# Altium project RGBColorSensor.PrjPcb
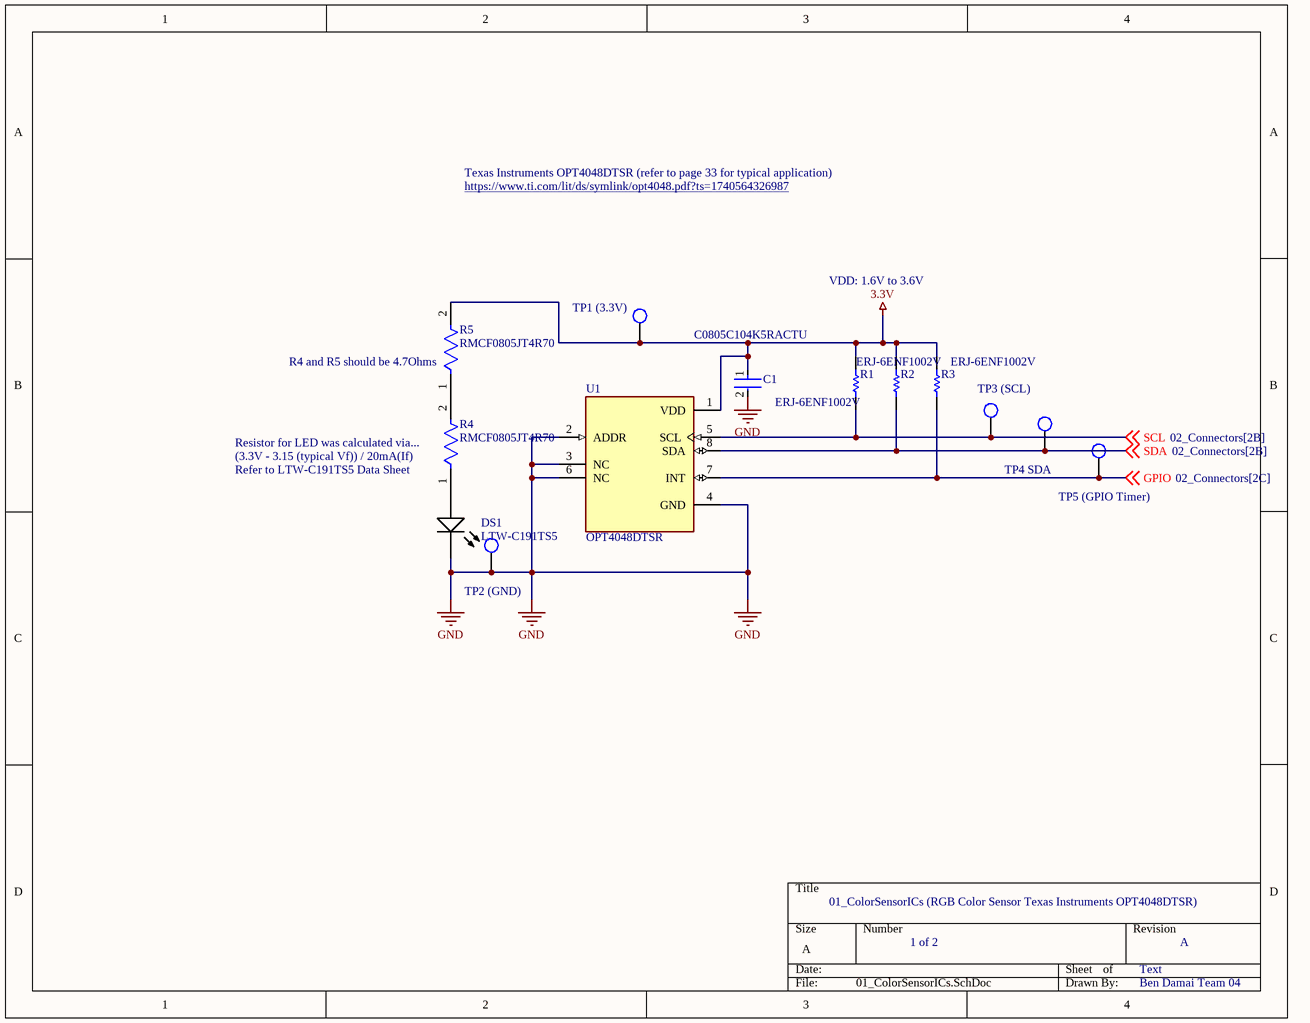
[diagram p0: 01_ColorSensorICs.SchDoc]
2 sheets, 14 parts. Net scope: global (net labels, ports and power ports of the same name join across sheets).
Board file: PCB1.PcbDoc
Sheets:
  01_ColorSensorICs.SchDoc
  02_Connectors.SchDoc

## Sheet 01_ColorSensorICs.SchDoc
size A; SheetNumber: 1; SheetTotal: 2

### Parts
C1  C0805C104K5RACTU  [FP-C0805C-DN-MFG]
DS1  LTW-C191TS5  [LTST-LTW-C191TS5_V]
R1  ERJ-6ENF1002V  [RESC2013X70X40ML20T20]
R2  ERJ-6ENF1002V  [RESC2013X70X40ML20T20]
R3  ERJ-6ENF1002V  [RESC2013X70X40ML20T20]
R4  RMCF0805JT4R70  [FP-RMCF0805-MFG]
R5  RMCF0805JT4R70  [FP-RMCF0805-MFG]
TP1_(3.3V)  TP_5019  [FP-5019-MFG]  (value not drawn)
TP2_(GND)  TP_5019  [FP-5019-MFG]  (value not drawn)
TP3_(SCL)  TP_5019  [FP-5019-MFG]  (value not drawn)
TP4_SDA  TP_5019  [FP-5019-MFG]  (value not drawn)
TP5_(GPIO_Timer)  TP_5019  [FP-5019-MFG]  (value not drawn)
U1  OPT4048DTSR  [SOTFL50P190X60-8N]

### Nets
3.3V: C1.1 R1.2 R2.2 R3.2 R5.2 TP1_(3.3V).1 U1.1(VDD)
GND: C1.2 DS1.2(K) TP2_(GND).1 U1.2(ADDR) U1.3(NC) U1.4(GND) U1.6(NC)
GPIO: R3.1 TP5_(GPIO_Timer).1 U1.7(INT) ; off-sheet GPIO
SCL: R1.1 TP3_(SCL).1 U1.5(SCL) ; off-sheet SCL
SDA: R2.1 TP4_SDA.1 U1.8(SDA) ; off-sheet SDA
NetDS1_1: DS1.1(A) R4.1
NetR4_2: R4.2 R5.1

### Notes on the sheet
- https://www.ti.com/lit/ds/symlink/opt4048.pdf?ts=1740564326987
- Texas Instruments OPT4048DTSR (refer to page 33 for typical application)
- VDD: 1.6V to 3.6V
- (near R5) R4 and R5 should be 4.7Ohms
- (near R4) Resistor for LED was calculated via...
- (near R4) (3.3V - 3.15 (typical Vf)) / 20mA(If)
- (near R4) Refer to LTW-C191TS5 Data Sheet
- 01_ColorSensorICs (RGB Color Sensor Texas Instruments OPT4048DTSR)
- 1 of 2
- Text
- A
- Ben Damai Team 04

### Library data of the parts
C1 = CMP-2007-00279-2: CAP CER 0.1UF 50V X7R 0805; Manufacturer: KEMET; Value: 0.10 μF; Tolerance: 0.1; Temperature Coefficient: 30ppm/°C; Material: Ceramic; Manufacturer Part Number: C0805C104K5RACTU; Device Class L2: Capacitors; Temperature Range Low: -55°C; Voltage Rating: 50 V; Digikey Description: CAP CER 0.1UF 50V X7R 0805; Category: Cap; ComponentLink2Description: Datasheet; Octopart: https://octopart.com/c0805c104k5ractu-kemet-143926; RoHS: TRUE; ComponentLink2URL: https://content.kemet.com/datasheets/KEM_C1003_C0G_SMD.pdf; Temperature Characteristic: X7R; Temperature: -55°C to +125°C; Height: 0.88mm; Temperature Range High: +125°C; Device Class L1: Passive Components; Automotive: No; Lead Free: Yes; Ipc Land Pattern Name: CAPC200125X78; Device Class L3: Ceramic Capacitors; Mouser Description: Cap Ceramic 0.1uF 50V X7R 10% SMD 2.0 x 1.2 mm 125 C Paper T/R; Capacitance: 0.10 μF; Package: C0805C-DN
DS1 = CMP-1674-00013-1: LED Uni-Color White, 70 mW, 20 mA, -20 to 80 degC, 2-Pin SMD, RoHS, Tape and Reel; Case\Package: 0603; Power Rating: 100 mW; Voltage Rating: 50 V; Tolerance: 1%; Resistance: 12 Ohm; Min Operating Temperature: -55 degC; Mount: Surface Mount; Pins: 2; Case Code (Imperial): 0603; PackageReference: LTW-C191TS5; ComponentLink2URL: http://optoelectronics.liteon.com/upload/download/DS22-2004-201/S_110_LTW-C191TS5.pdf; REACH SVHC: No SVHC; Max Operating Temperature: 155 degC; DatasheetVersion: Rev. B, 06/2010; Packaging: Tape and Reel; RoHSCompliant: true; Height: 0.45 mm; Length: 1.6 mm; Width: 0.8 mm; Voltage Rating (DC): 50 V; ComponentLink1URL: http://www.us.liteon.com/; PackageDescription: 2-Pin Surface Mount Device, Body 1.6 x 0.8 mm; ComponentLink1Description: Manufacturer URL; Case Code (Metric): 1608; Package Quantity: 5000; ComponentLink2Description: Datasheet
R1-R3 = CMP-2001-04376-1: Manufacturer: Panasonic; Part Number: ERJ-6ENF1002V
R4 R5 = CMP-26527-005191-1: 4.7Ω ±5% 0.125W 0805 Thick Film Chip Resistor AEC-Q200 compliant; Resistance: 4.7R; Temperature Coefficient: 200ppm/°C; Max Power Dissipation: 125mW; Height: 0.026inch; RoHS Compliant: Yes; Length: 0.079inch; Features: Automotive AEC-Q200; Case Code (Metric): 2012; Radiation Hardening: No; Case Code (Imperial): 0805; Resistor Type: Thick Film; Contact Plating: Tin; Tolerance: 5%; Packaging: Tape and Reel; Max Operating Temperature: 155°C; Number of Terminations: 2; Series: RMCF; Width: 0.049inch; Case/Package: 0805; Min Operating Temperature: -55°C; Mount: Surface Mount; Lead Free: Lead Free
TP1_(3.3V) TP2_(GND) TP3_(SCL) TP4_SDA TP5_(GPIO_Timer) = TP_5019: Test Point, Mini, SMT, Phos Bronze/Silver, 1000pc Tape & Reel | Keystone Electronics 5019; Manufacturer Part Number: 5019; Plating: Silver; Body Material: Bronze; Number of Contacts: 1NUMBER; Supplier 1: Digikey; Supplier Part Number 1: 36-5019CT-ND; Manufacturer: Keystone Electronics; RoHS: Yes; Category: Terminals; Stock: 282853; Pricing: 1=0.37, 25=0.2496, 100=0.2117, 250=0.1902, 500=0.1756, 1000=0.16229, 2000=0.15019, 3000=0.14362, 5000=0.13585, 7000=0.13102, 10000=0.12613, 25000=0.1211 (USD); Mounting Technology: Surface Mount,PCB; Pins: 1; Contact Plating: Silver; Contact Material: Bronze; Material: Bronze; Packaging: Tape and Reel; Package Quantity: 1; Termination: SMD/SMT; Series: 5019; Height: 0.09inch; Reach SVHC Compliant: No; RoHS Compliant: Yes; Lead Free: Lead Free; ComponentLink1URL: https://datasheet.ciiva.com/14848/m60-2p61-14848437.pdf?src-supplier=Digikey; ComponentLink1Description: https://datasheet.ciiva.com/14848/m60-2p61-14848437.pdf?src-supplier=Digikey; ComponentLink2URL: https://datasheet.ciiva.com/14848/m60-2p61-14848438.pdf?src-supplier=Digikey; ComponentLink2Description: https://datasheet.ciiva.com/14848/m60-2p61-14848438.pdf?src-supplier=Digikey; ComponentLink3URL: https://datasheet.ciiva.com/14848/m60-2p61-14848439.pdf?src-supplier=Digikey; ComponentLink3Description: https://datasheet.ciiva.com/14848/m60-2p61-14848439.pdf?src-supplier=Digikey; ComponentLink4URL: https://datasheet.ciiva.com/16885/70182998-16885945.pdf?src-supplier=Allied+Electronics; ComponentLink4Description: https://datasheet.ciiva.com/16885/70182998-16885945.pdf?src-supplier=Allied+Electronics; ComponentLink5URL: https://datasheet.ciiva.com/16318/m60-2p61-16318395.pdf?src-supplier=Future+Electronics; ComponentLink5Description: https://datasheet.ciiva.com/16318/m60-2p61-16318395.pdf?src-supplier=Future+Electronics
U1 = OPT4048DTSR: High-speed high-precision tristimulus XYZ color sensor; MF: Texas Instruments; SnapEDA_Link: https://www.snapeda.com/parts/OPT4048DTSR/Texas+Instruments/view-part/?ref=snap; Package: None; Value: *; MP: OPT4048DTSR; Check_prices: https://www.snapeda.com/parts/OPT4048DTSR/Texas+Instruments/view-part/?ref=eda

## Sheet 02_Connectors.SchDoc
size A; SheetNumber: 2; SheetTotal: 2
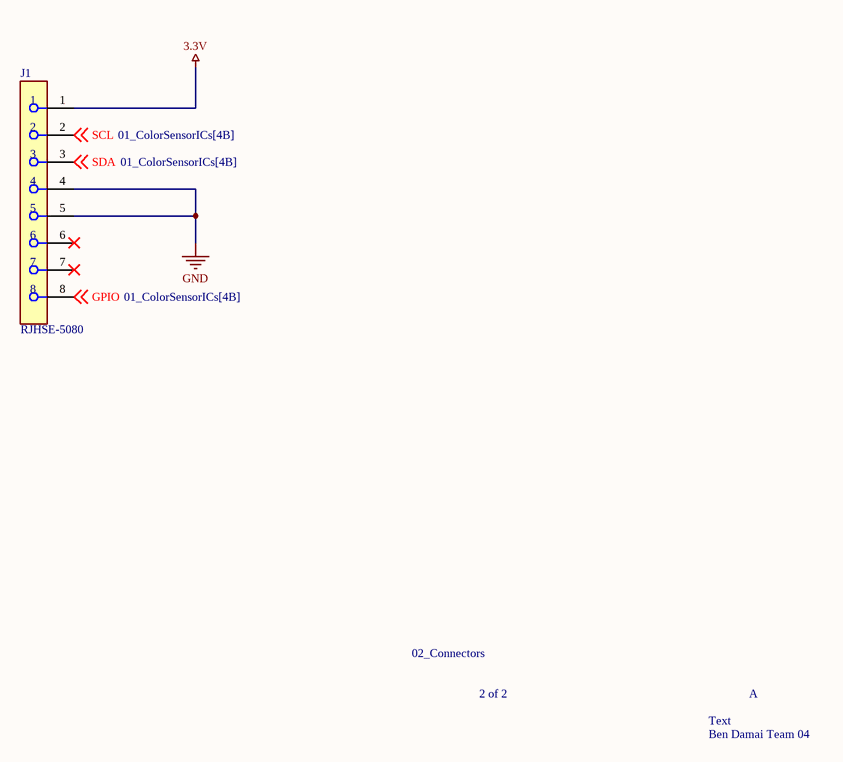
[diagram p1: 02_Connectors.SchDoc]

### Parts
J1  RJHSE-5080  [FP-RJHSE-5080-MFG]

### Nets
3.3V: J1.1
GND: J1.4 J1.5
GPIO: J1.8 ; off-sheet GPIO
SCL: J1.2 ; off-sheet SCL
SDA: J1.3 ; off-sheet SDA

Not connected (* = marked no-connect by the designer): J1 6* 7*

### Notes on the sheet
- 02_Connectors
- 2 of 2
- Text
- A
- Ben Damai Team 04

### Library data of the parts
J1 = CMP-02366-000003-1: CONN MOD JACK 8P8C R/A UNSHLD; Manufacturer: Amphenol; Current Rating: 1.5A; Voltage Rating: 125V; Pitch: 1.02mm; Conn Orientation: Right Angle; Number Of Contacts: 8; Is Female: yes; Conn Gender: Female; Contact Resistance: 20mR; Number of Ports: 1; Connector Type: RJ45; Lead Free: Yes; Device Class L3: unset; Footprint Url: https://cdn.amphenol-icc.com/media/wysiwyg/files/drawing/rjhse5080.pdf?__cf_chl_jschl_tk__=e349db0bbbb6188a39347cd5e541b92fa02c9719-1587748343-0-AW7tChdeHzRPLX9gSWj7WrKaXQoY9BsmT9Ek0h-T62M9y3Rs9iypFcOtkzb-6sGYQEjFE-jcoNciDETCOZrh1rYyOesac5SvYLoLwHIsHvF4AKBlx-MXmfZUVk9OTTJLqyQq2qMm0PFRLJpNcK0nrKResqOniRSYixG2sPTmOPraH-ULJFBDL602CHqcI9KKBgTq90Jh1OL2Td4moJ99rFsJRJ1Tk_uoxGe8ublcP_ARu-uLpWcQrBcwOcHDTAwL29DAwVaqcH7ta8Ks7WMlHmVl_pILeEDwT0bE9vu5Pa5S3PtNRF1leuFkgi_FMbUxTDulc5xzbXSfng8srUIV1lWXny5nx1fZJEUa_w97yKjffzBMxiWLWVN-V7-uqAaPbyv_m-wRyw5O25OZNyJOeGU; ComponentLink2URL: https://cdn.amphenol-icc.com/media/wysiwyg/files/documentation/datasheet/inputoutput/io-modjack-rjhse.pdf; Device Class L1: Connectors; Package: CONN_MOD_JACK; Mouser Description: Modular Connectors / Ethernet Connectors R/A RJ45 NONSHIELDED 8 CONT NO LEDS; Manufacturer Part Number: RJHSE-5080; Octopart: https://octopart.com/rjhse-5080-amphenol-45060; Category: Conn; Height: 0.535inch; Temperature: -55°C to +85°C; Digikey Description: CONN MOD JACK 8P8C R/A UNSHLD; Device Class L2: Modular / Ethernet Connectors; Contact Material: Gold,Nickel; ComponentLink2Description: Datasheet; Temperature Range Low: -55°C; RoHS: TRUE; Automotive: No; Temperature Range High: +85°C; Supplier: Digikey; Supplier Part Number: RJHSE-5080-ND; Stock: 72112; Pricing: 1=1.03, 10=0.867, 25=0.832, 50=0.8142, 100=0.7788, 250=0.708, 500=0.6372, 1000=0.56641, 2500=0.51331 (USD); Mounting Technology: Through Hole,Panel; Contact Plating: Gold; Max Current Rating: 1.5A; Number of Positions Loaded: 8; Max Voltage Rating (AC): 125V; Orientation: Right Angle; Packaging: Rail/Tube; Gender: Female; Termination: Solder; Number of Positions: 8; Voltage Rating (DC): 125V; Length: 15.75mm; Depth: 14.99mm; Radiation Hardening: No; RoHS Compliant: Yes; Reach SVHC Compliant: Unknown; ComponentLink1URL: https://datasheet.ciiva.com/7629/1682821-7629402.pdf?src-supplier=Element14; ComponentLink1Description: https://datasheet.ciiva.com/7629/1682821-7629402.pdf?src-supplier=Element14; ComponentLink3URL: https://datasheet.ciiva.com/1432/1693748-1432448.pdf?src-supplier=Element14; ComponentLink3Description: https://datasheet.ciiva.com/1432/1693748-1432448.pdf?src-supplier=Element14

## Nets that join several sheets
3.3V: 01_ColorSensorICs (7 pins), 02_Connectors (J1.1)
GND: 01_ColorSensorICs (7 pins), 02_Connectors (J1.4 J1.5)
GPIO: 01_ColorSensorICs (R3.1 TP5_(GPIO_Timer).1 U1.7), 02_Connectors (J1.8)
SCL: 01_ColorSensorICs (R1.1 TP3_(SCL).1 U1.5), 02_Connectors (J1.2)
SDA: 01_ColorSensorICs (R2.1 TP4_SDA.1 U1.8), 02_Connectors (J1.3)